# Altium schematic sheet Перечень элементов.SchDoc
size 209 x 297 mm; ApprovedBy: 1; CheckedBy: 2; Author: 3; SheetNumber: 1; SheetTotal: 1; Разработал: Гончаренко В.Ю.; Проверил: Смолин В.А.; Обозначение: СФ МЭИ ПЭ2-18 11.03.04 03 ПЭ3; Наименование1: Плата печатная; Наименование2: Перечень элементов; Литера2: У; Утвердил: Рассказа Д.С.; Компания: СФ НИУ МЭИ
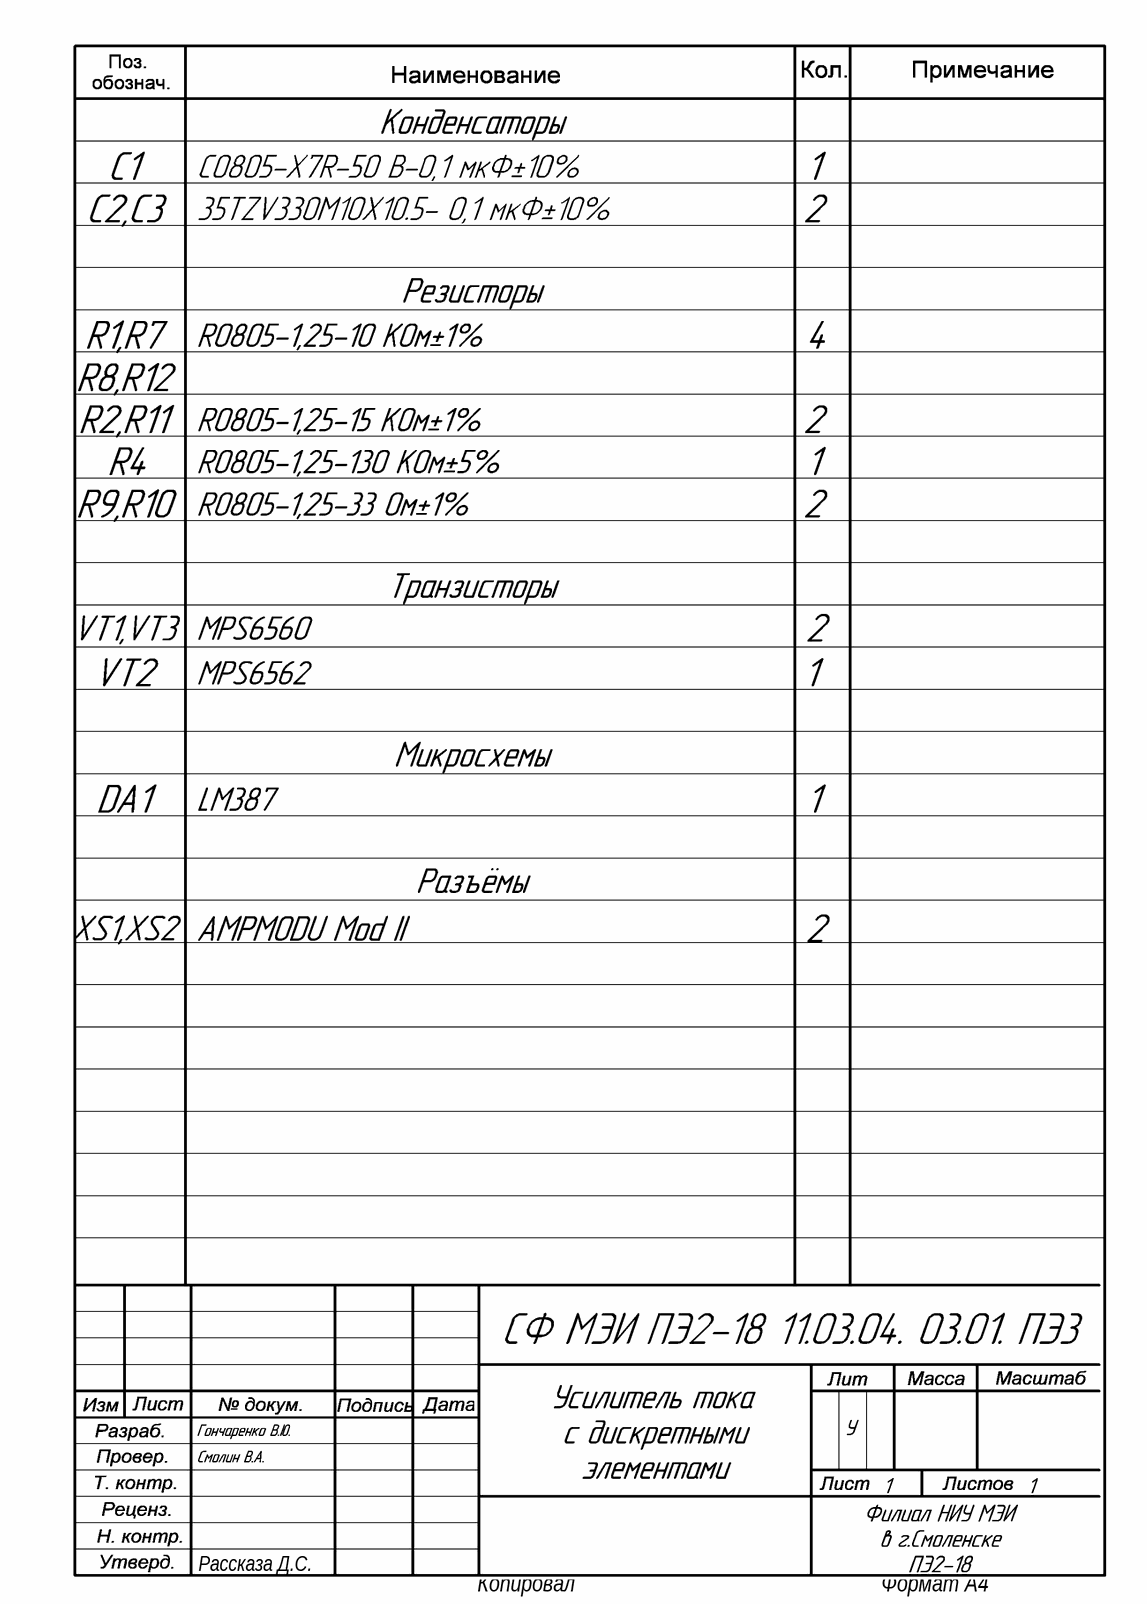
[diagram p0: Перечень элементов.SchDoc]

## Notes on the sheet
- Рассказа Д.С.
- Перв. примен.
- Справ. №
- Подп. и дата
- Инв. № дубл.
- Взам. инв. №
- Разраб.
- Изм.
- Лист
- № докум.
- Подп.
- Дата
- Лит.
- Масса
- Масштаб
- Пров.
- Т. контр.
- Листов
- Инв. № подл.
- Н. контр.
- Утв.
- Копировал
- Формат А4